# EAGLE schematic sumorobot (EAGLE 5.11)
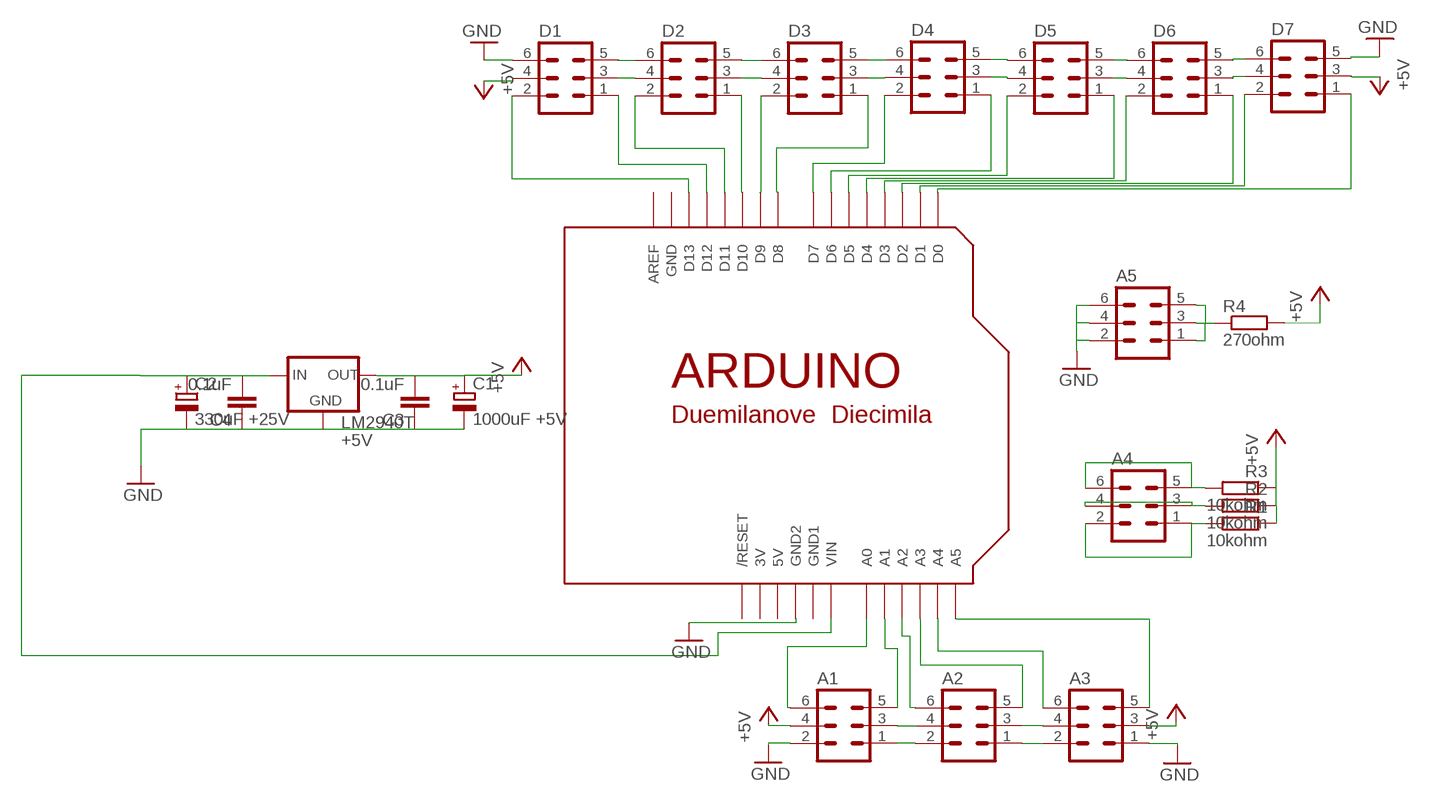
[diagram p0: schematic, sheet 1]

## Parts
A1  MA03-2  [MA03-2]
A2  MA03-2  [MA03-2]
A3  MA03-2  [MA03-2]
A4  MA03-2  [MA03-2]
A5  MA03-2  [MA03-2]
C1  1000uF +5V  CPOL-EUE5-10.5  [E5-10,5]
C2  330uF +25V  CPOL-EUE5-10.5  [E5-10,5]
C3  0.1uF  C-EUC0805  [C0805]
C4  0.1uF  C-EUC0805  [C0805]
D1  MA03-2  [MA03-2]
D2  MA03-2  [MA03-2]
D3  MA03-2  [MA03-2]
D4  MA03-2  [MA03-2]
D5  MA03-2  [MA03-2]
D6  MA03-2  [MA03-2]
D7  MA03-2  [MA03-2]
LM2940T  +5V  78XXL  [78XXL]
R1  10kohm  R-EU_R0805  [R0805]
R2  10kohm  R-EU_R0805  [R0805]
R3  10kohm  R-EU_R0805  [R0805]
R4  270ohm  R-EU_R0805  [R0805]
U$1  ARDUINOUNO  [ARDUINO]

## Nets
+5V: A1.4 A3.3 C1.+ C3.2 D1.4 D7.3 LM2940T.OUT R1.1 R2.1 R3.1 R4.2
D4: D4.1 U$1.D6
GND: A1.1 A1.2 A2.1 A2.2 A3.1 A3.2 A5.2 A5.4 A5.6 C1.- C2.- C3.1 C4.1 D1.5 D1.6 D2.5 D2.6 D3.5 D3.6 D4.5 D4.6 D5.5 D5.6 D6.5 D6.6 D7.5 D7.6 LM2940T.GND U$1.GND2
N$2: A3.6 U$1.A4
N$3: A2.3 A3.4
N$5: A1.3 A2.4
N$6: A3.5 U$1.A5
N$7: C2.+ C4.2 LM2940T.IN U$1.VIN
N$8: A1.6 U$1.A0
N$9: A1.5 U$1.A1
N$10: A5.1 A5.3 A5.5 R4.1
N$11: D5.1 U$1.D4
N$12: D6.2 U$1.D3
N$13: D6.1 U$1.D2
N$14: D7.2 U$1.D1
N$16: D6.3 D7.4
N$17: D6.4
N$19: D4.3 D5.4
N$21: D3.3 D4.4
N$24: D2.3 D3.4
N$25: D2.4
N$27: D1.2 U$1.D13
N$28: D1.1 U$1.D12
N$29: D2.2 U$1.D11
N$30: D2.1 U$1.D10
N$31: D3.2 U$1.D9
N$32: D3.1 U$1.D8
N$33: D4.2 U$1.D7
N$34: A2.6 U$1.A2
N$35: D5.2 U$1.D5
N$36: D7.1 U$1.D0
N$37: A2.5 U$1.A3
N$38: A4.3 A4.4 R2.2
N$39: A4.1 A4.2 R1.2
N$40: A4.5 A4.6 R3.2
Unconnected: D1.3 D5.3 U$1.AREF U$1.RESET(/RESET)

## Power pins joined to a net without a drawn wire
3V: U$1.3V
5V: U$1.5V
GND: U$1.GND
GND1: U$1.GND1

## Library data of the parts
A1-A5 D1-D7 = con-lstb:MA03-2: PIN HEADER; OC_FARNELL: unknown; OC_NEWARK: unknown
C1 C2 = rcl:CPOL-EU: POLARIZED CAPACITOR, European symbol
C3 C4 = rcl:C-EU: CAPACITOR, European symbol
LM2940T = v-reg:78XXL: VOLTAGE REGULATOR
R1-R4 = rcl:R-EU_: RESISTOR, European symbol
U$1 = adafruit:ARDUINO: Arduino Diecimila/Duemilanove Make a shield with ease, this package has all the named pins as well as the two mounting drill holes and an outline of the USB and DC power connector. The outline is on the DIMENSION layer, so if your board house uses it they will cut the outline to match. http://www.ladyada.net/library/pcb/eaglelibrary.html